# EAGLE design Atmega32AU-Basic (EAGLE 7.6.0)
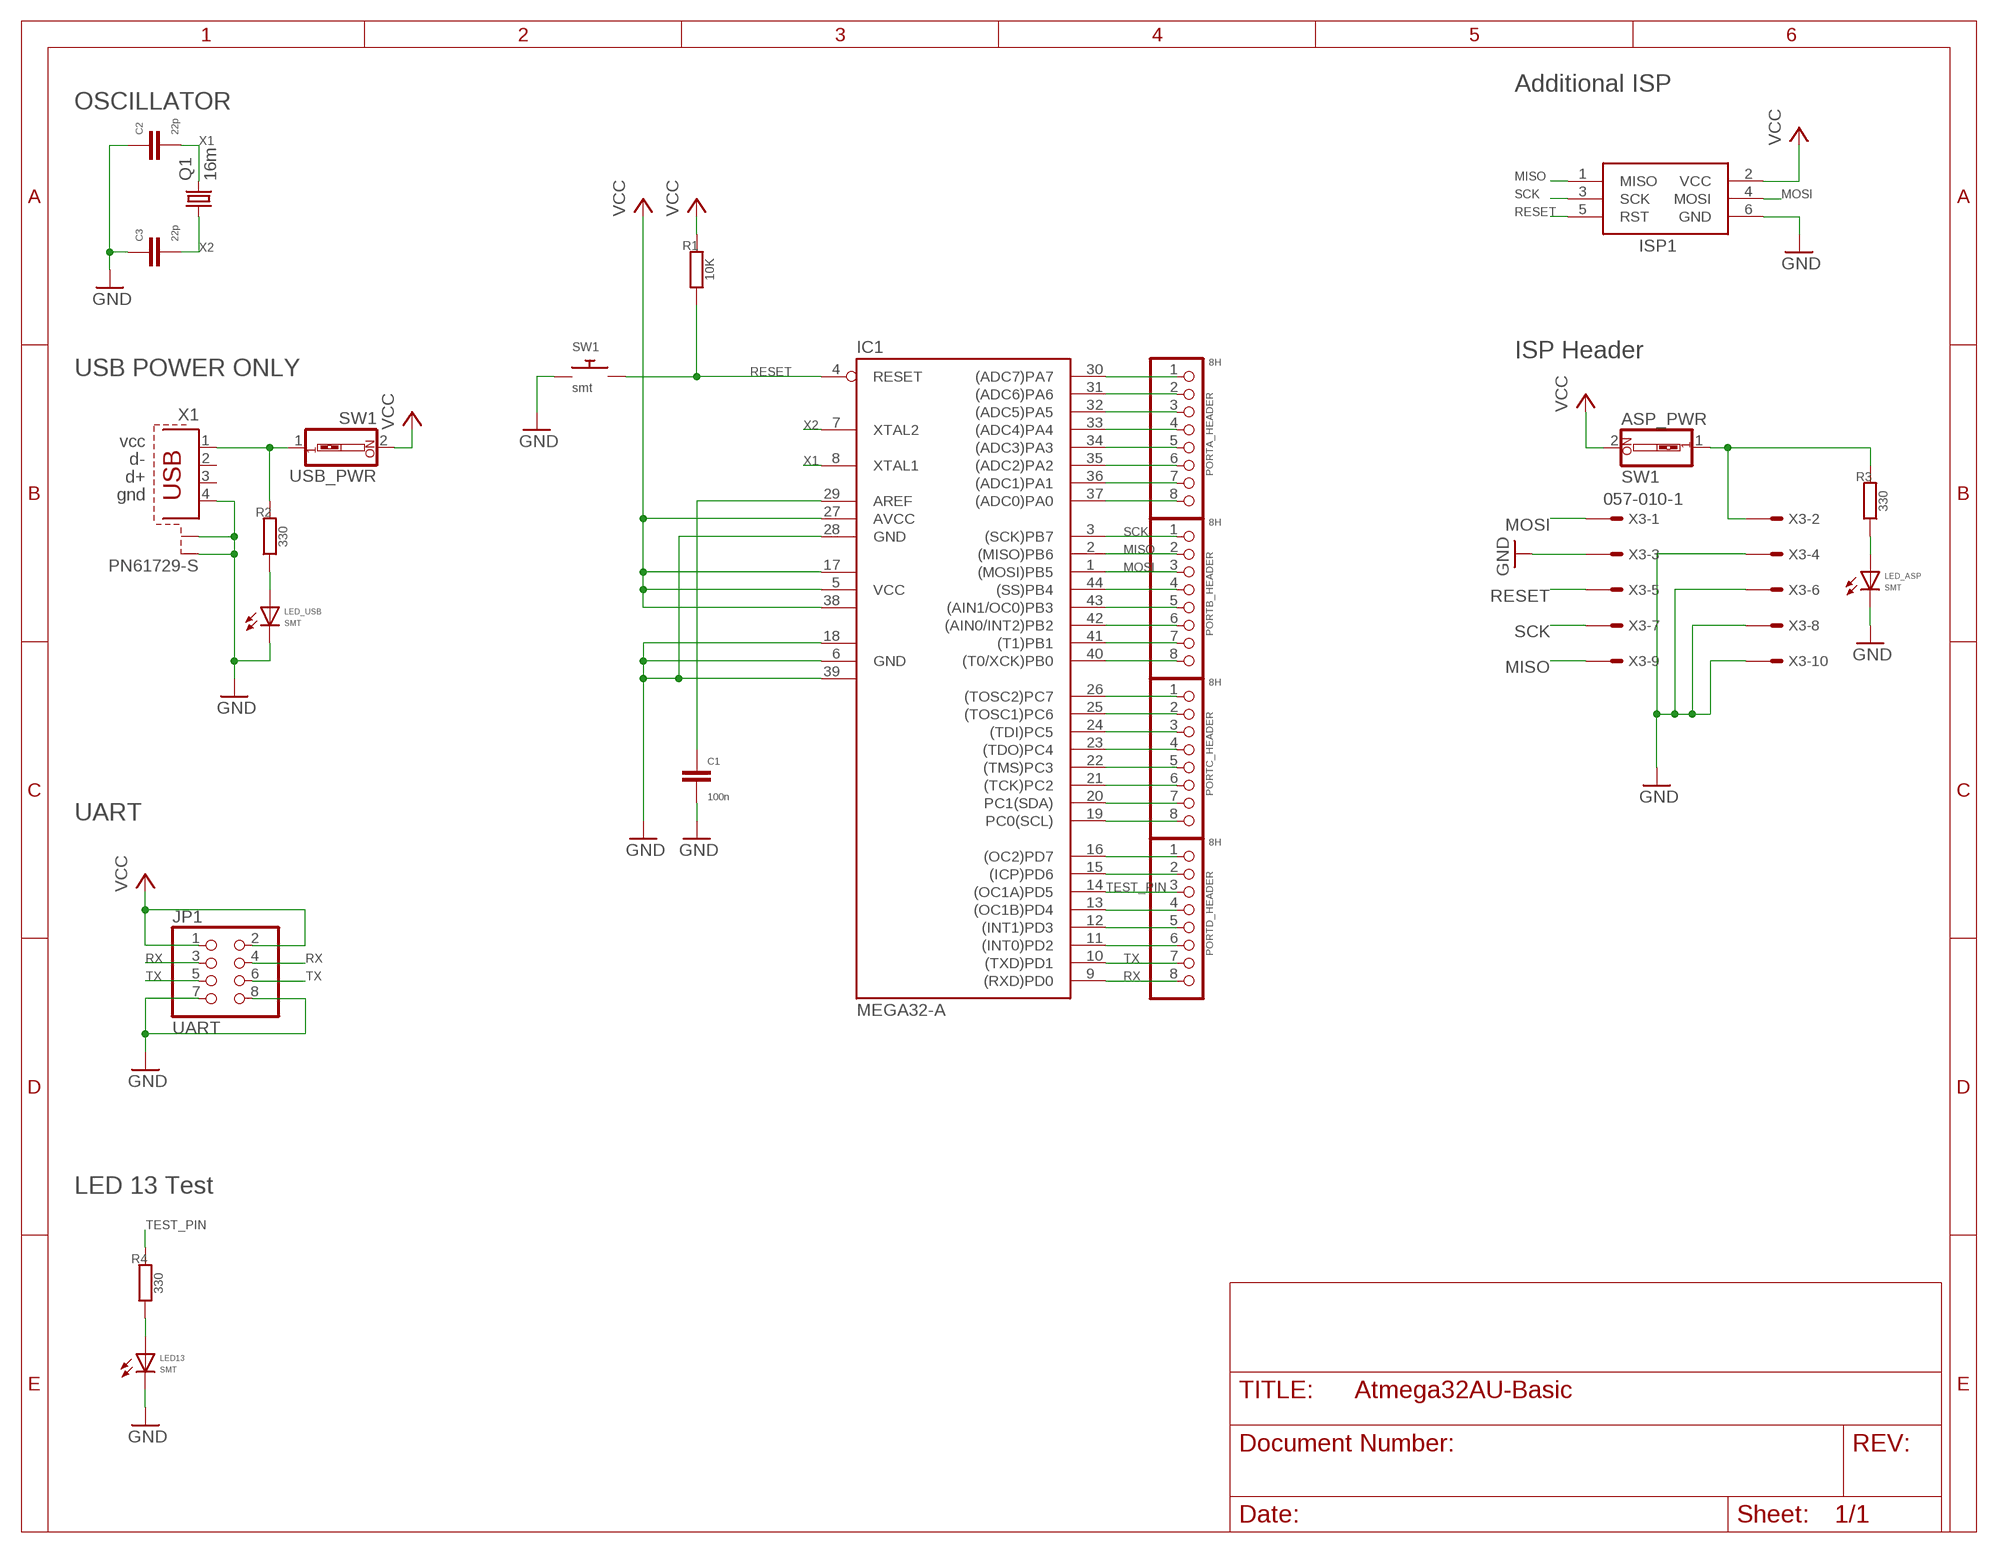
[diagram p0: schematic, sheet 1]

## Parts
ASP_PWR  SW1  SW_DIP-1  [EDG-01]
C1  100n  C-EUC1206  [C1206]
C2  22p  C-EUC1206  [C1206]
C3  22p  C-EUC1206  [C1206]
IC1  MEGA32-A  [TQFP44]
ISP1  AVRISP-6  [AVRISP]
JP1  UART  PINHD-2X4  [2X04]
LED13  SMT  LEDSMT1206  [1206]
LED_ASP  SMT  LEDSMT1206  [1206]
LED_USB  SMT  LEDSMT1206  [1206]
PORTA_HEADER  8H  PINHD-1X8BIG  [1X08-BIG]
PORTB_HEADER  8H  PINHD-1X8BIG  [1X08-BIG]
PORTC_HEADER  8H  PINHD-1X8BIG  [1X08-BIG]
PORTD_HEADER  8H  PINHD-1X8BIG  [1X08-BIG]
Q1  16m  CRYSTALHC49UP  [HC49UP]
R1  10K  R-EU_M1206  [M1206]
R2  330  R-EU_M1206  [M1206]
R3  330  R-EU_M1206  [M1206]
R4  330  R-EU_M1206  [M1206]
SW1  smt  SWITCH_PUSHBUTTONEVQ-PE  [TACT_PANA-EVQ]
USB_PWR  SW1  SW_DIP-1  [EDG-01]
X1  PN61729-S  [PN61729-S]
X3  057-010-1  [057-010-1]

## Nets
GND: C1.2 C2.1 C3.1 IC1.6(GND) IC1.18(GND1) IC1.28(GND) IC1.39(GND2) ISP1.6(GND) JP1.7 JP1.8 LED13.C LED_ASP.C LED_USB.C SW1.P$1 X1.4 X1.S1 X1.S2 X3.3 X3.4 X3.6 X3.8 X3.10
MISO: IC1.2((MISO)PB6) ISP1.1(MISO) PORTB_HEADER.2 X3.9
MOSI: IC1.1((MOSI)PB5) ISP1.4(MOSI) PORTB_HEADER.3 X3.1
N$1: C1.1 IC1.29(AREF)
N$2: IC1.30((ADC7)PA7) PORTA_HEADER.1
N$3: IC1.31((ADC6)PA6) PORTA_HEADER.2
N$4: IC1.32((ADC5)PA5) PORTA_HEADER.3
N$5: IC1.33((ADC4)PA4) PORTA_HEADER.4
N$6: IC1.34((ADC3)PA3) PORTA_HEADER.5
N$7: IC1.35((ADC2)PA2) PORTA_HEADER.6
N$8: IC1.36((ADC1)PA1) PORTA_HEADER.7
N$9: R2.2 USB_PWR.1 X1.1
N$10: ASP_PWR.1 R3.2 X3.2
N$11: LED_USB.A R2.1
N$12: LED13.A R4.1
N$13: IC1.44((SS)PB4) PORTB_HEADER.4
N$14: IC1.43((AIN1/OC0)PB3) PORTB_HEADER.5
N$15: IC1.42((AIN0/INT2)PB2) PORTB_HEADER.6
N$16: IC1.41((T1)PB1) PORTB_HEADER.7
N$17: LED_ASP.A R3.1
N$18: IC1.26((TOSC2)PC7) PORTC_HEADER.1
N$19: IC1.25((TOSC1)PC6) PORTC_HEADER.2
N$20: IC1.24((TDI)PC5) PORTC_HEADER.3
N$21: IC1.23((TDO)PC4) PORTC_HEADER.4
N$22: IC1.22((TMS)PC3) PORTC_HEADER.5
N$23: IC1.21((TCK)PC2) PORTC_HEADER.6
N$24: IC1.20(PC1(SDA)) PORTC_HEADER.7
N$26: IC1.16((OC2)PD7) PORTD_HEADER.1
N$27: IC1.15((ICP)PD6) PORTD_HEADER.2
N$29: IC1.13((OC1B)PD4) PORTD_HEADER.4
N$30: IC1.12((INT1)PD3) PORTD_HEADER.5
N$31: IC1.11((INT0)PD2) PORTD_HEADER.6
PA0: IC1.37((ADC0)PA0) PORTA_HEADER.8
PB0: IC1.40((T0/XCK)PB0) PORTB_HEADER.8
RESET: IC1.4(RESET) ISP1.5(RST) R1.1 SW1.P$2 X3.5
RX: IC1.9((RXD)PD0) JP1.3 JP1.4 PORTD_HEADER.8
SCK: IC1.3((SCK)PB7) ISP1.3(SCK) PORTB_HEADER.1 X3.7
SCL: IC1.19(PC0(SCL)) PORTC_HEADER.8
TEST_PIN: IC1.14((OC1A)PD5) PORTD_HEADER.3 R4.2
TX: IC1.10((TXD)PD1) JP1.5 JP1.6 PORTD_HEADER.7
VCC: ASP_PWR.2 IC1.5(VCC) IC1.17(VCC1) IC1.27(AVCC) IC1.38(VCC2) ISP1.2(VCC) JP1.1 JP1.2 R1.2 USB_PWR.2
X1: C2.2 IC1.8(XTAL1) Q1.2
X2: C3.2 IC1.7(XTAL2) Q1.1
Unconnected: X1.2 X1.3

## Notes on the sheet
- Additional ISP
- OSCILLATOR
- ISP Header
- USB POWER ONLY
- vcc
- d-
- d+
- gnd
- UART
- LED 13 Test

## Library data of the parts
ASP_PWR USB_PWR = special:SW_DIP-1: DIP SWITCH
C1-C3 = resistor:C-EU: CAPACITOR, European symbol
IC1 = atmel:MEGA32: MICROCONTROLLER 32 Kbytes FLASH 2 Kbytes SRAM 1 Kbytes EEPROM USART 8-channel 10 bit ADC Source: www.atmel.com .. doc2503.pdf; MPN: ATMEGA32-16AU; OC_FARNELL: 9171274; OC_NEWARK: 69K6677
ISP1 = adafruit:AVRISP: AVR ISP HEADER Standard 6 pin header for AVR programming
JP1 = adafruit:PINHD-2X4: PIN HEADER
LED13 LED_ASP LED_USB = adafruit:LED: LED OSRAM: - CHIPLED LG R971, LG N971, LY N971, LG Q971, LY Q971, LO R971, LY R971 LH N974, LH R974 LS Q976, LO Q976, LY Q976 LO Q996 - Hyper CHIPLED LW Q18S LB Q993, LB Q99A, LB R99A - SideLED LS A670, LO A670, LY A670, LG A670, LP A670 LB A673, LV A673, LT A673, LW A673 LH A674 LY A675 LS A676, LA A676, LO A676, LY A676, LW A676 LS A679, LY A679, LG A679 - Hyper Micro SIDELED® LS Y876, LA Y876, LO Y876, LY Y876 LT Y87S - SmartLED LW L88C, LW L88S LB L89C, LB L89S, LG L890 LS L89K, LO L89K, LY L89K LS L896, LA L896, LO L896, LY L896 - TOPLED LS T670, LO T670, LY T670, LG T670, LP T670 LSG T670, LSP T670, LSY T670, LOP T670, LYG T670 LG T671, LOG T671, LSG T671 LB T673, LV T673, LT T673, LW T673 LH T674 LS T676, LA T676, LO T676, LY T676, LB T676, LH T676, LSB T676, LW T676 LB T67C, LV T67C, LT T67C, LS T67K, LO T67K, LY T67K, LW E67C LS E67B, LA E67B, LO E67B, LY E67B, LB E67C, LV E67C, LT E67C LW T67C LS T679, LY T679, LG T679 LS T770, LO T770, LY T770, LG T770, LP T770 LB T773, LV T773, LT T773, LW T773 LH T774 LS E675, LA E675, LY E675, LS T675 LS T776, LA T776, LO T776, LY T776, LB T776 LHGB T686 LT T68C, LB T68C - Hyper Mini TOPLED® LB M676 - Mini TOPLED Santana® LG M470 LS M47K, LO M47K, LY M47K Source: http://www.osram.convergy.de/
PORTA_HEADER PORTB_HEADER PORTC_HEADER PORTD_HEADER = adafruit:PINHD-1X8: PIN HEADER
Q1 = adafruit:CRYSTAL: CRYSTAL; OC_FARNELL: unknown; OC_NEWARK: unknown
R1-R4 = resistor:R-EU_: RESISTOR, European symbol
SW1 = adafruit:SWITCH_PUSHBUTTON: Buttons SOFTTOUCHSMD_SJ - Soft touch temporary push button (Super Junk Akihabara) Compatible with SKPMANE010 [Mouser: 688-SKPMAN] C&K_KSS = Digikey: KSS221GLFS
X1 = con-berg:PN61729-S: BERG USB connector; OC_FARNELL: unknown; OC_NEWARK: unknown
X3 = con-panduit:057-010-: CONNECTOR 10-pin series 057 contact pc board low profile headers; OC_FARNELL: unknown; OC_NEWARK: unknown

## Board
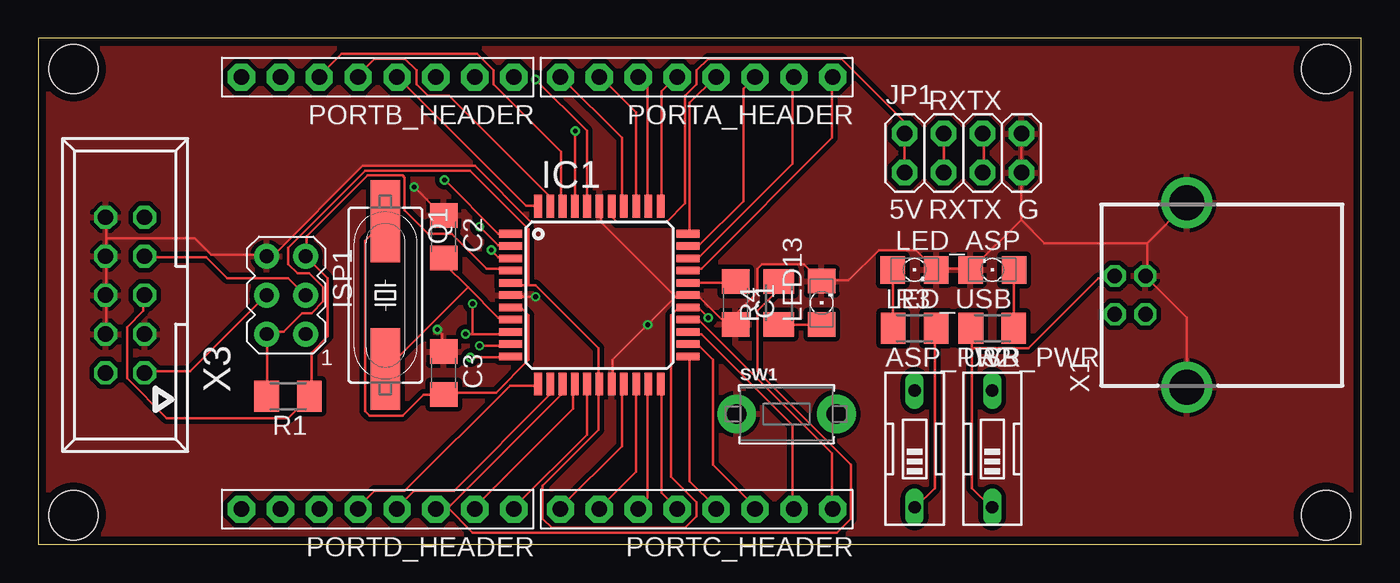
[diagram p1: board, top side]
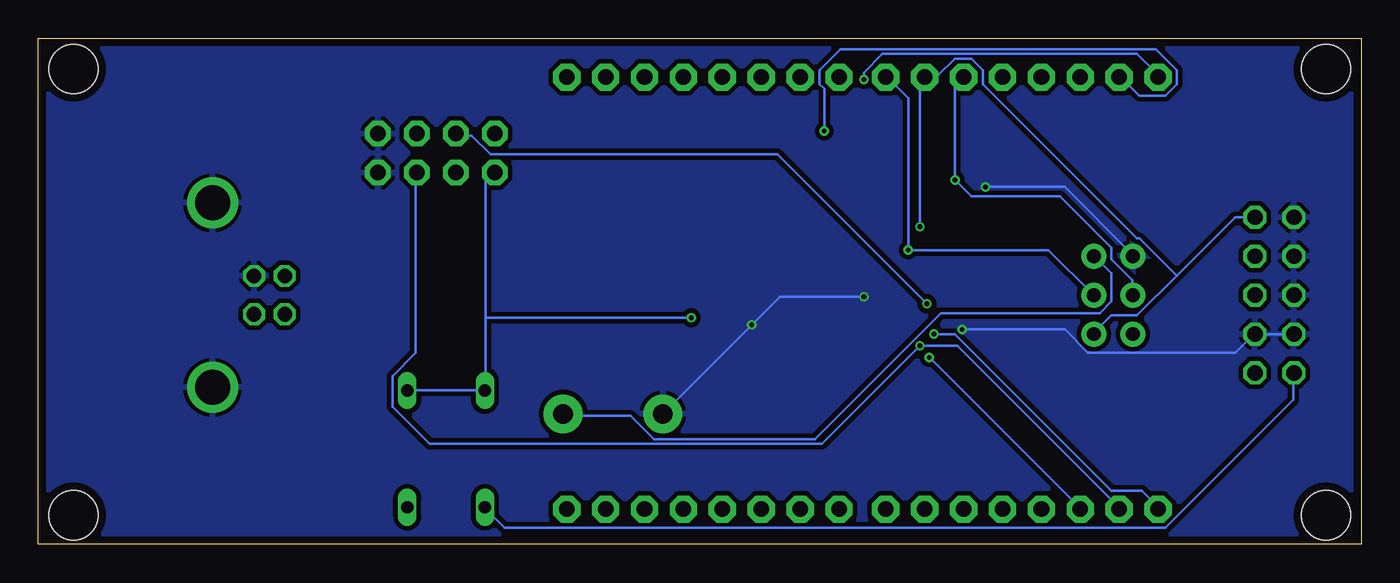
[diagram p2: board, bottom side, seen from below]

Size 86.36 x 33.02 mm. Coordinates in mm from the lower left corner, seen from the top.
Outline: 86.36,33.02 0,33.02 0,0 86.36,0 86.36,33.02
Copper layers (1*16): Top 0.035mm / dielectric 1.6mm / Bottom 0.035mm
Design rules "Elecrow_2-layer_PCB_eagle_rule": minimum track width 6mil, minimum drill 12mil, track to track 6mil, track to pad 8mil, pad to pad 12mil, via to via 12mil, smd to smd 0mil, copper to edge 20mil, drill to drill 10mil, minimum pad ring 6mil, minimum via ring 6mil, stop-mask expansion 0mil, vias tented up to drill 100mil, thermal gap 10mil
Holes 3.2 mm at 2.29,1.89 2.29,31.03 84.07,31.03 84.07,1.89

### Footprints (pad centres in the part's own frame; a part is rotated, then mirrored left to right if it is on the bottom)
EDG-01 = drill 0.813 long: 1 0,-3.81; 2 0,3.81
C1206 = smd 1.6 x 1.8: 1 -1.4,0; 2 1.4,0
TQFP44 = smd 1.5 x 0.5: 1 -5.8,4; 2 -5.8,3.2; 3 -5.8,2.4; 4 -5.8,1.6; 5 -5.8,0.8; 6 -5.8,0; 7 -5.8,-0.8; 8 -5.8,-1.6; 9 -5.8,-2.4; 10 -5.8,-3.2; 11 -5.8,-4; 23 5.8,-4; 24 5.8,-3.2; 25 5.8,-2.4; 26 5.8,-1.6; 27 5.8,-0.8; 28 5.8,0; 29 5.8,0.8; 30 5.8,1.6; 31 5.8,2.4; 32 5.8,3.2; 33 5.8,4 | smd 0.5 x 1.5: 12 -4,-5.8; 13 -3.2,-5.8; 14 -2.4,-5.8; 15 -1.6,-5.8; 16 -0.8,-5.8; 17 0,-5.8; 18 0.8,-5.8; 19 1.6,-5.8; 20 2.4,-5.8; 21 3.2,-5.8; 22 4,-5.8; 34 4,5.8; 35 3.2,5.8; 36 2.4,5.8; 37 1.6,5.8; 38 0.8,5.8; 39 0,5.8; 40 -0.8,5.8; 41 -1.6,5.8; 42 -2.4,5.8; 43 -3.2,5.8; 44 -4,5.8
AVRISP = drill 0.9 pad 1.626: 1 -1.27,2.54; 2 1.27,2.54; 3 -1.27,0; 4 1.27,0; 5 -1.27,-2.54; 6 1.27,-2.54
2X04 = drill 1.016 pad 1.676 octagon: 1 -3.81,-1.27; 2 -3.81,1.27; 3 -1.27,-1.27; 4 -1.27,1.27; 5 1.27,-1.27; 6 1.27,1.27; 7 3.81,-1.27; 8 3.81,1.27
1206 = smd 1.6 x 1.803: A -1.422,0; C 1.422,0
1X08-BIG = drill 1.016 pad 1.778 octagon: 1 -8.89,0; 2 -6.35,0; 3 -3.81,0; 4 -1.27,0; 5 1.27,0; 6 3.81,0; 7 6.35,0; 8 8.89,0
HC49UP = smd 5.334 x 1.93: 1 -4.826,0; 2 4.826,0
M1206 = smd 1.6 x 2: 1 -1.4,0; 2 1.4,0
TACT_PANA-EVQ = drill 1.3 pad 2.54: P$1 -3.25,0; P$2 3.25,0
PN61729-S = drill 0.95 octagon: 1 1.25,4.71; 2 -1.25,4.71; 3 -1.25,2.71; 4 1.25,2.71 | drill 2.3 pad 2.9: S1 -6.02,0; S2 6.02,0
057-010-1 = drill 1 octagon: 1 -5.08,-1.27; 2 -5.08,1.27; 3 -2.54,-1.27; 4 -2.54,1.27; 5 0,-1.27; 6 0,1.27; 7 2.54,-1.27; 8 2.54,1.27; 9 5.08,-1.27; 10 5.08,1.27

### Placement (x,y rotation side)
ASP_PWR  57.2,6.23 0 top
C1  45.52,15.75 270 top
C2  26.47,20.07 270 top
C3  26.47,11.18 270 top
IC1  36.63,16.26 0 top
ISP1  16.18,16.26 180 top
JP1  60.38,25.53 0 top
LED13  51.14,15.75 90 top
LED_ASP  57.2,17.91 0 top
LED_USB  62.28,17.91 180 top
PORTA_HEADER  42.98,30.49 180 top
PORTB_HEADER  22.15,30.49 180 top
PORTC_HEADER  42.98,2.29 180 top
PORTD_HEADER  22.15,2.29 180 top
Q1  22.66,16.26 270 top
R1  16.31,9.66 180 top
R2  62.28,14.1 180 top
R3  57.2,14.1 0 top
R4  48.35,15.75 90 top
SW1  48.84,8.5 0 top
USB_PWR  62.28,6.23 0 top
X1  74.98,16.26 90 top
X3  5.66,16.26 90 top

### Tracks (layer width: path | path; a pad name or v marks a point on that pad's centre or on a via)
GND  (via drill 0.3)
  Top 0.152: v24.54,23.32 26.36,21.49 C2.1 | 4.42,19.96 4.42,21.34 X3.10 | 4.42,19.96 4.42,18.9 X3.8 4.42,18.75 4.42,16.31 X3.6 4.42,16.15 4.42,13.87 X3.4 | v26.06,14.02 26.36,13.72 26.36,12.65 C3.1 | 4.42,19.96 10.21,19.96 11.28,18.9 14.78,18.9 ISP1.6 14.94,18.9 15.39,18.9 21.18,24.69 28.5,24.69 32.16,21.03 36.73,21.03 | v32.46,16.15 30.94,16.15 IC1.6 | 72.39,19.66 72.39,17.53 X1.4 72.39,17.37 74.98,14.78 X1.S1 | 72.39,19.66 74.98,22.25 X1.S2 | 41.6,16.15 v39.78,14.33 37.49,12.04 37.49,10.52 IC1.18 | 41.6,16.15 42.37,16.15 IC1.28 42.52,16.15 43.13,16.15 44.81,14.48 45.41,14.48 C1.2 45.57,14.48 45.57,15.09 46.94,16.46 46.94,17.98 47.24,18.29 49.99,18.29 51.05,17.22 LED13.C 51.21,17.22 52.88,17.22 54.86,19.2 57.3,19.2 58.52,17.98 LED_ASP.C 58.67,17.98 60.81,17.98 LED_USB.C 60.96,17.98 64.16,21.18 | 36.73,21.03 36.73,21.95 IC1.39 | 41.6,16.15 36.73,21.03 | JP1.8 64.16,26.67 64.16,24.38 JP1.7 64.16,24.23 64.16,21.18 | 72.39,19.66 65.68,19.66 64.16,21.18
  Bottom 0.152: v24.54,23.32 19.36,23.32 14.94,18.9 ISP1.6 | v26.06,14.02 19.36,14.02 17.83,12.5 8.23,12.5 7.01,13.72 X3.3 6.86,13.72 4.42,13.72 X3.4 | v32.46,16.15 37.95,16.15 v39.78,14.33 45.57,8.53 SW1.P$1
  pour Bottom (isolate 0.305): 0,33.02 86.36,33.02 86.36,0 0,0
  pour Top (isolate 0.305): 0,33.02 86.36,33.02 86.36,0 0,0
MISO  (via drill 0.3)
  Top 0.152: v28.8,20.73 30.02,19.51 30.79,19.51 IC1.2
  Bottom 0.152: v28.8,20.73 28.8,30.18 PORTB_HEADER.2 28.5,30.63 27.58,30.63 26.52,31.7 25.45,31.7 24.69,30.94 24.69,30.02 14.63,19.96 14.48,19.96 12.04,17.53 | 12.04,17.53 14.63,14.94 16.31,14.94 17.37,13.87 ISP1.1 | 12.04,17.53 8.23,21.34 7.01,21.34 X3.9
MOSI  (via drill 0.3)
  Top 0.152: X3.1 7.01,11.28 9.91,11.28 14.78,16.15 ISP1.4 | v26.52,23.77 30.02,20.27 30.79,20.27 IC1.1
  Bottom 0.152: PORTB_HEADER.3 26.06,30.48 26.52,30.02 v26.52,23.77 25.45,22.71 19.66,22.71 16.31,19.36 16.31,18.59 14.94,17.22 14.94,16.31 ISP1.4
N$1
  Top 0.152: IC1.29 42.52,17.07 45.41,17.07 C1.1
N$2
  Top 0.152: IC1.30 42.52,17.98 43.28,17.98 51.82,26.52 51.82,30.48 PORTA_HEADER.1
N$3
  Top 0.152: IC1.31 42.52,18.75 43.13,18.75 49.23,24.84 49.23,30.48 PORTA_HEADER.2
N$4
  Top 0.152: IC1.32 42.52,19.51 43.13,19.51 46.02,22.4 46.02,29.72 PORTA_HEADER.3
N$5
  Top 0.152: IC1.33 42.52,20.27 42.52,28.8 44.2,30.48 PORTA_HEADER.4
N$6
  Top 0.152: IC1.34 40.69,22.1 40.69,29.57 41.6,30.48 PORTA_HEADER.5
N$7
  Top 0.152: IC1.35 39.78,22.1 39.78,29.87 PORTA_HEADER.6
N$8
  Top 0.152: IC1.36 39.01,22.1 39.01,28.19 36.73,30.48 PORTA_HEADER.7
N$9
  Top 0.152: 60.96,12.8 60.96,3.66 62.18,2.44 USB_PWR.1 | 60.96,12.8 60.96,14.02 R2.2 | 60.96,12.8 64.62,12.8 69.19,17.37 70.26,17.37 X1.1
N$10
  Top 0.152: R3.2 58.52,14.02 58.52,3.66 57.3,2.44 ASP_PWR.1
  Bottom 0.152: X3.2 4.42,11.12 4.42,9.45 12.8,1.07 55.93,1.07 57.15,2.29 ASP_PWR.1
N$11
  Top 0.152: LED_USB.A 63.7,17.83 63.7,14.17 R2.1
N$12
  Top 0.152: LED13.A 51.05,14.33 48.46,14.33 R4.1
N$13
  Top 0.152: IC1.44 32.61,22.1 31.85,22.1 23.47,30.48 PORTB_HEADER.4
N$14
  Top 0.152: IC1.43 33.38,22.1 33.38,22.71 26.82,29.26 25.45,29.26 24.69,30.02 24.69,30.94 23.93,31.7 21.95,31.7 20.88,30.63 PORTB_HEADER.5
N$15
  Top 0.152: IC1.42 34.14,22.1 34.14,25.6 29.72,30.02 29.72,30.94 28.65,32 19.81,32 18.44,30.63 PORTB_HEADER.6
N$16  (via drill 0.3)
  Top 0.152: v35.05,26.98 35.05,22.1 IC1.41
  Bottom 0.152: v35.05,26.98 35.05,29.72 35.36,30.02 35.36,30.94 33.98,32.31 13.41,32.31 12.04,30.94 12.04,30.02 12.8,29.26 14.48,29.26 15.7,30.48 PORTB_HEADER.7
N$17
  Top 0.152: LED_ASP.A 55.78,17.83 55.78,14.17 R3.1
N$18
  Top 0.152: IC1.26 42.52,14.63 43.13,14.63 51.82,5.94 51.82,2.44 PORTC_HEADER.1
N$19
  Top 0.152: IC1.25 42.52,13.72 43.28,13.72 49.23,7.77 49.23,2.44 PORTC_HEADER.2
N$20
  Top 0.152: IC1.24 42.52,12.95 43.13,12.95 44.04,12.04 44.04,5.18 46.79,2.44 PORTC_HEADER.3
N$21
  Top 0.152: IC1.23 42.52,12.19 42.52,4.12 44.2,2.44 PORTC_HEADER.4
N$22
  Top 0.152: IC1.22 40.69,10.36 40.69,3.35 41.6,2.44 PORTC_HEADER.5
N$23
  Top 0.152: IC1.21 39.78,10.36 39.78,3.05 39.17,2.44 PORTC_HEADER.6
N$24
  Top 0.152: IC1.20 39.01,10.36 39.01,4.72 36.73,2.44 PORTC_HEADER.7
N$26
  Top 0.152: IC1.16 35.81,10.36 35.81,7.16 31.09,2.44 PORTD_HEADER.1
N$27
  Top 0.152: IC1.15 34.9,10.36 34.9,8.84 28.5,2.44 PORTD_HEADER.2
N$29
  Top 0.152: IC1.13 33.38,10.36 33.38,9.75 27.13,3.5 24.54,3.5 23.47,2.44 PORTD_HEADER.4
N$30
  Top 0.152: IC1.12 32.61,10.36 30.79,10.36 23.93,3.5 21.95,3.5 20.88,2.44 PORTD_HEADER.5
N$31  (via drill 0.3)
  Top 0.152: v28.19,12.19 30.79,12.19 IC1.11
  Bottom 0.152: v28.19,12.19 18.44,2.44 PORTD_HEADER.6
PA0
  Top 0.152: IC1.37 38.1,22.1 38.1,26.52 34.14,30.48 PORTA_HEADER.8
PB0  (via drill 0.3)
  Top 0.152: v32.46,30.33 35.81,26.98 35.81,22.1 IC1.40
  Bottom 0.152: v32.46,30.33 32.46,30.79 31.24,32 14.63,32 13.26,30.63 PORTB_HEADER.8
RESET
  Top 0.152: IC1.4 30.79,17.98 29.26,17.98 26.98,20.27 25.45,20.27 23.93,21.79 23.93,23.93 23.77,24.08 21.49,24.08 17.53,20.12 17.53,18.9 ISP1.5 17.53,18.75 18.9,17.37 18.9,13.56 17.83,12.5 17.83,9.75 R1.1 17.68,9.6 16.31,8.23 8.38,8.23 5.79,10.82 5.79,14.17 6.86,15.24 6.86,16.15 X3.5
  Bottom 0.152: SW1.P$2 51.97,8.38 47.7,8.38 46.18,6.86 35.66,6.86 27.43,15.09 17.07,15.09 16.31,15.85 16.31,17.68 17.37,18.75 ISP1.5
RX  (via drill 0.3)
  Top 0.152: JP1.3 59.13,24.38 59.13,26.67 JP1.4 | v27.89,13.72 28.35,13.72 | 28.35,13.72 30.79,13.72 IC1.9 | 28.35,13.72 v28.35,15.7
  Bottom 0.152: v27.89,13.72 26.52,13.72 16.31,3.5 14.33,3.5 13.26,2.44 PORTD_HEADER.8 | v28.35,15.7 38.1,25.45 56.84,25.45 58.06,26.67 58.98,26.67 JP1.4
SCK  (via drill 0.3)
  Top 0.152: v29.57,19.2 30.02,18.75 30.79,18.75 IC1.3 | X3.7 7.01,18.75 10.97,18.75 12.34,17.37 16.31,17.37 17.37,16.31 ISP1.3
  Bottom 0.152: PORTB_HEADER.1 30.94,30.48 29.57,29.11 v29.57,19.2 20.42,19.2 17.53,16.31 ISP1.3
SCL
  Top 0.152: IC1.19 38.1,10.36 38.1,6.4 34.14,2.44 PORTC_HEADER.8
TEST_PIN
  Top 0.152: 26.67,2.44 26.06,2.44 PORTD_HEADER.3 26.67,2.44 | 26.67,2.44 26.82,2.44 34.14,9.75 34.14,10.36 IC1.14 | 26.67,2.44 28.35,0.76 52.12,0.76 53.03,1.68 53.03,5.18 46.94,11.28 46.94,15.24 48.31,16.61 48.31,17.07 R4.2
TX  (via drill 0.3)
  Top 0.152: JP1.5 61.72,24.38 61.72,26.67 JP1.6 | v28.8,12.95 30.79,12.95 IC1.10
  Bottom 0.152: PORTD_HEADER.7 15.85,2.44 26.36,12.95 v28.8,12.95 35.2,6.55 60.81,6.55 63.25,8.99 63.25,10.97 61.72,12.5 61.72,24.23 JP1.5
VCC  (via drill 0.3)
  Top 0.152: IC1.38 37.49,21.95 37.49,21.34 37.8,21.03 41,21.03 42.22,22.25 42.22,29.26 42.98,30.02 42.98,30.94 43.74,31.7 52.43,31.7 56.54,27.58 56.54,26.82 JP1.2 56.54,26.67 56.54,24.38 JP1.1 | R1.2 14.94,9.75 14.94,13.72 ISP1.2 14.94,13.87 16,13.87 17.22,15.09 17.83,15.09 18.59,15.85 18.59,16.76 17.68,17.68 16.92,17.68 16.31,18.29 16.31,19.36 21.34,24.38 28.19,24.38 32,20.57 32,16.92 | 32,16.92 32.46,16.92 36.58,12.8 36.58,10.52 IC1.17 36.58,10.36 36.58,7.47 32.92,3.81 32.92,1.68 33.53,1.07 42.22,1.07 42.98,1.83 42.98,2.74 41.3,4.42 41.3,14.94 41.76,15.39 42.37,15.39 IC1.27 42.52,15.39 43.13,15.39 v43.74,14.78 | 32,16.92 30.94,16.92 IC1.5
  Bottom 0.152: USB_PWR.2 62.18,10.06 57.3,10.06 ASP_PWR.2 57.15,10.06 57.15,14.78 | 57.15,14.78 57.15,23.77 56.69,24.23 JP1.1 | v43.74,14.78 57.15,14.78
X1
  Top 0.152: 28.04,16.76 26.52,18.29 26.52,18.59 C2.2 | 28.04,16.76 30.02,14.78 30.79,14.78 IC1.8 | 28.04,16.76 22.71,11.43 Q1.2
X2
  Top 0.152: IC1.7 30.94,15.39 31.55,15.39 32,14.94 32,12.04 29.87,9.91 26.52,9.91 C3.2 26.36,9.75 25.15,9.75 23.77,8.38 21.64,8.38 21.34,8.69 21.34,19.81 22.55,21.03 Q1.1

### Text on the board
tPlace: RX | TX | 5V | RX | TX | G